# Altium schematic sheet Sheet3.SchDoc
size A2
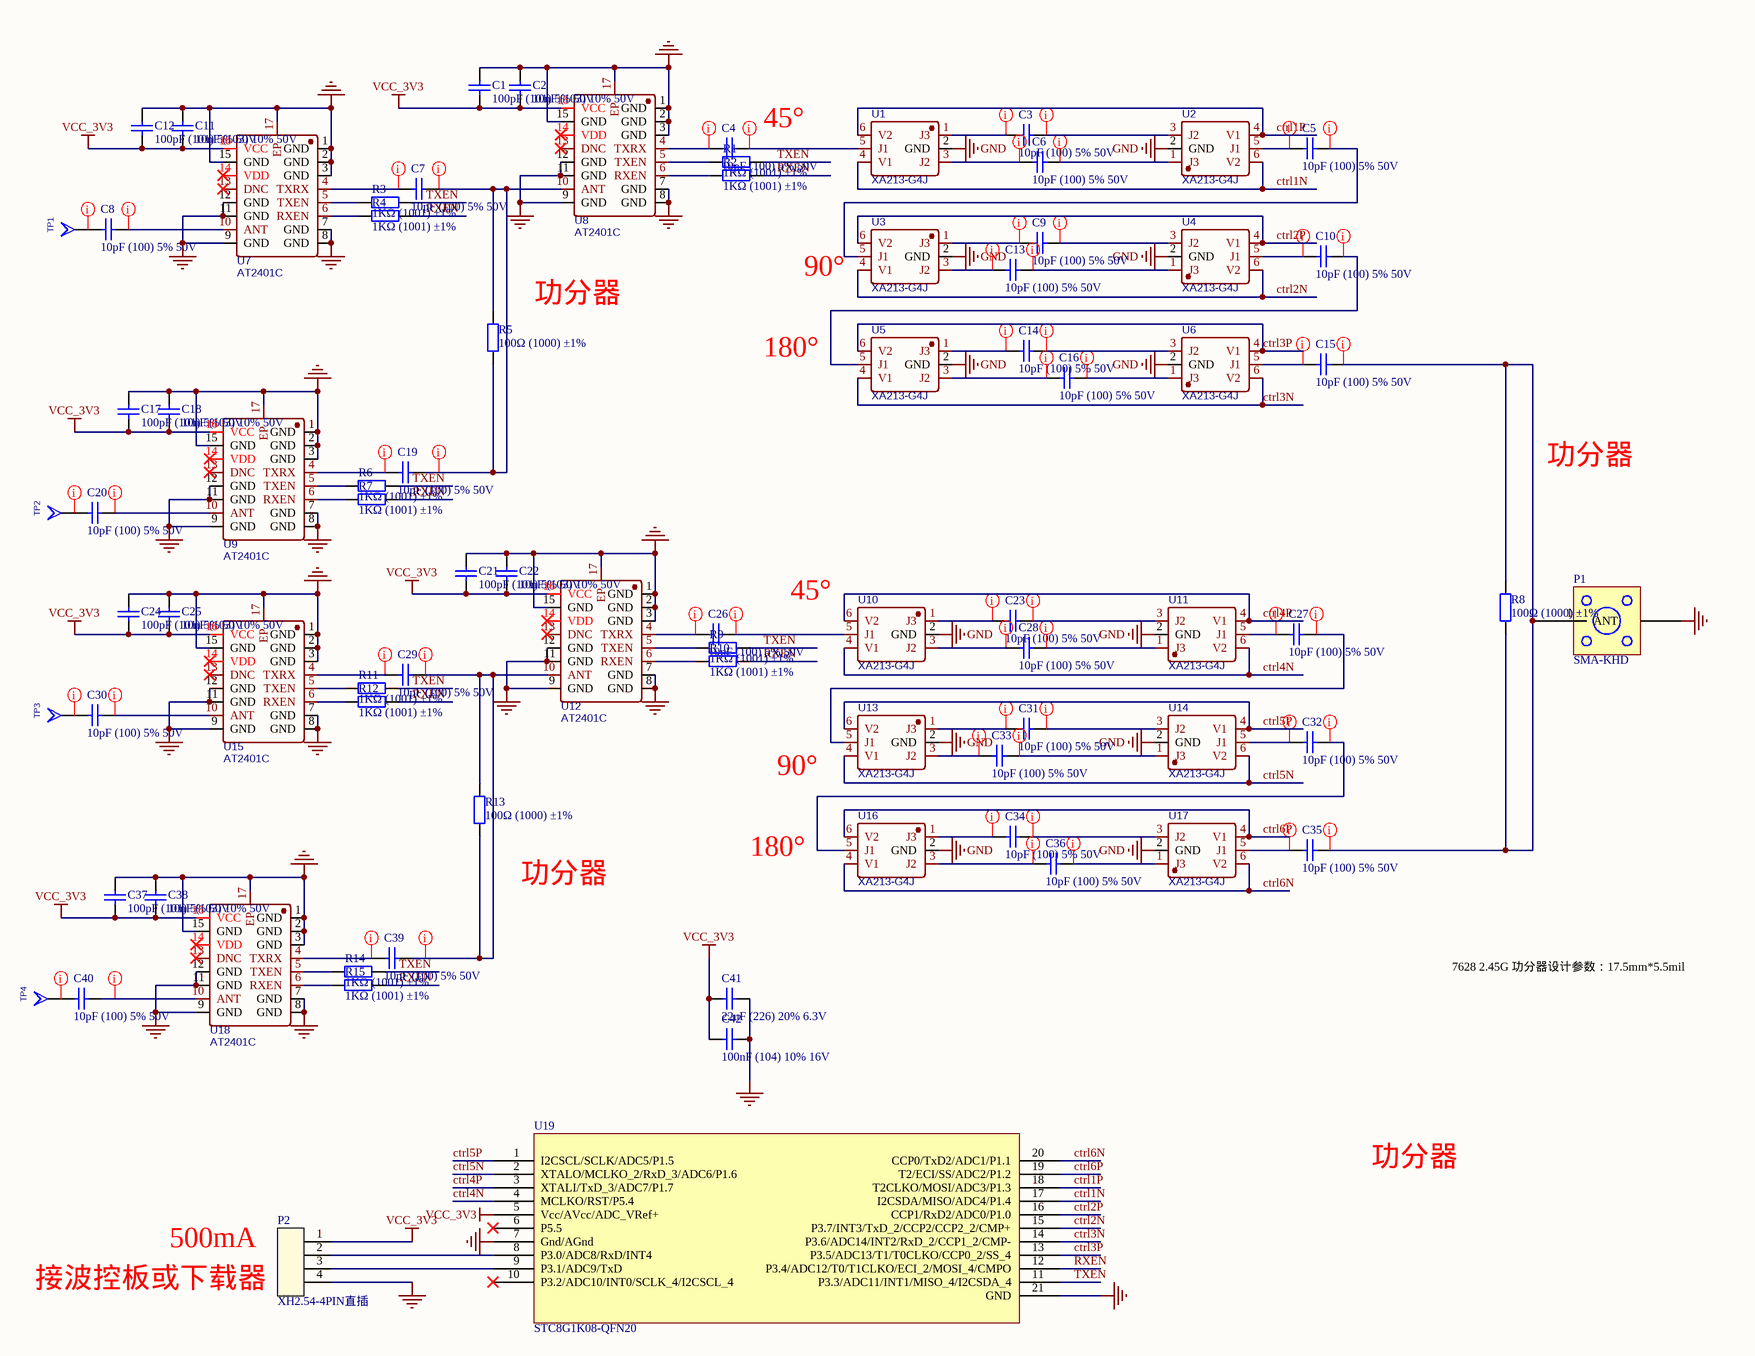
[diagram p0: Sheet3.SchDoc]

## Parts
C1  100pF (101) 5% 50V  [0402_C]
C2  10nF (103) 10% 50V  [0402_C]
C3  10pF (100) 5% 50V  [0402_C]
C4  10pF (100) 5% 50V  [0402_C]
C5  10pF (100) 5% 50V  [0402_C]
C6  10pF (100) 5% 50V  [0402_C]
C7  10pF (100) 5% 50V  [0402_C]
C8  10pF (100) 5% 50V  [0402_C]
C9  10pF (100) 5% 50V  [0402_C]
C10  10pF (100) 5% 50V  [0402_C]
C11  10nF (103) 10% 50V  [0402_C]
C12  100pF (101) 5% 50V  [0402_C]
C13  10pF (100) 5% 50V  [0402_C]
C14  10pF (100) 5% 50V  [0402_C]
C15  10pF (100) 5% 50V  [0402_C]
C16  10pF (100) 5% 50V  [0402_C]
C17  100pF (101) 5% 50V  [0402_C]
C18  10nF (103) 10% 50V  [0402_C]
C19  10pF (100) 5% 50V  [0402_C]
C20  10pF (100) 5% 50V  [0402_C]
C21  100pF (101) 5% 50V  [0402_C]
C22  10nF (103) 10% 50V  [0402_C]
C23  10pF (100) 5% 50V  [0402_C]
C24  100pF (101) 5% 50V  [0402_C]
C25  10nF (103) 10% 50V  [0402_C]
C26  10pF (100) 5% 50V  [0402_C]
C27  10pF (100) 5% 50V  [0402_C]
C28  10pF (100) 5% 50V  [0402_C]
C29  10pF (100) 5% 50V  [0402_C]
C30  10pF (100) 5% 50V  [0402_C]
C31  10pF (100) 5% 50V  [0402_C]
C32  10pF (100) 5% 50V  [0402_C]
C33  10pF (100) 5% 50V  [0402_C]
C34  10pF (100) 5% 50V  [0402_C]
C35  10pF (100) 5% 50V  [0402_C]
C36  10pF (100) 5% 50V  [0402_C]
C37  100pF (101) 5% 50V  [0402_C]
C38  10nF (103) 10% 50V  [0402_C]
C39  10pF (100) 5% 50V  [0402_C]
C40  10pF (100) 5% 50V  [0402_C]
C41  22uF (226) 20% 6.3V  [0603_C]
C42  100nF (104) 10% 16V  [0402_C]
P1  SMA-KHD  [SMA-KHD]
P2  XH2.54-4PIN直插  [XH2.54-4PIN直插]
R1  1KΩ (1001) ±1%  [0402_R]
R2  1KΩ (1001) ±1%  [0402_R]
R3  1KΩ (1001) ±1%  [0402_R]
R4  1KΩ (1001) ±1%  [0402_R]
R5  100Ω (1000) ±1%  [0402_R]
R6  1KΩ (1001) ±1%  [0402_R]
R7  1KΩ (1001) ±1%  [0402_R]
R8  100Ω (1000) ±1%  [0402_R]
R9  1KΩ (1001) ±1%  [0402_R]
R10  1KΩ (1001) ±1%  [0402_R]
R11  1KΩ (1001) ±1%  [0402_R]
R12  1KΩ (1001) ±1%  [0402_R]
R13  100Ω (1000) ±1%  [0402_R]
R14  1KΩ (1001) ±1%  [0402_R]
R15  1KΩ (1001) ±1%  [0402_R]
TP1  TP-1  [040_TESTPOINT]  (value not drawn)
TP2  TP-1  [040_TESTPOINT]  (value not drawn)
TP3  TP-1  [040_TESTPOINT]  (value not drawn)
TP4  TP-1  [040_TESTPOINT]  (value not drawn)
U1  XA213-G4J  [SOT-363_L2.0-W1.3-P0.65-LS2.1-BR]
U2  XA213-G4J  [SOT-363_L2.0-W1.3-P0.65-LS2.1-BR]
U3  XA213-G4J  [SOT-363_L2.0-W1.3-P0.65-LS2.1-BR]
U4  XA213-G4J  [SOT-363_L2.0-W1.3-P0.65-LS2.1-BR]
U5  XA213-G4J  [SOT-363_L2.0-W1.3-P0.65-LS2.1-BR]
U6  XA213-G4J  [SOT-363_L2.0-W1.3-P0.65-LS2.1-BR]
U7  AT2401C  [QFN-16_L3.0-W3.0-P0.50-BL-EP1.7]
U8  AT2401C  [QFN-16_L3.0-W3.0-P0.50-BL-EP1.7]
U9  AT2401C  [QFN-16_L3.0-W3.0-P0.50-BL-EP1.7]
U10  XA213-G4J  [SOT-363_L2.0-W1.3-P0.65-LS2.1-BR]
U11  XA213-G4J  [SOT-363_L2.0-W1.3-P0.65-LS2.1-BR]
U12  AT2401C  [QFN-16_L3.0-W3.0-P0.50-BL-EP1.7]
U13  XA213-G4J  [SOT-363_L2.0-W1.3-P0.65-LS2.1-BR]
U14  XA213-G4J  [SOT-363_L2.0-W1.3-P0.65-LS2.1-BR]
U15  AT2401C  [QFN-16_L3.0-W3.0-P0.50-BL-EP1.7]
U16  XA213-G4J  [SOT-363_L2.0-W1.3-P0.65-LS2.1-BR]
U17  XA213-G4J  [SOT-363_L2.0-W1.3-P0.65-LS2.1-BR]
U18  AT2401C  [QFN-16_L3.0-W3.0-P0.50-BL-EP1.7]
U19  STC8G1K08-QFN20  [QFN20(3x3)]

## Nets
GND: C1.2 C2.2 C11.2 C12.2 C17.2 C18.2 C21.2 C22.2 C24.2 C25.2 C37.2 C38.2 C41.2 C42.2 P1.0(GND) P2.4 U1.2(GND) U2.2(GND) U3.2(GND) U4.2(GND) U5.2(GND) U6.2(GND) U7.1(GND) U7.2(GND) U7.3(GND) U7.7(GND) U7.8(GND) U7.9(GND) U7.11(GND) U7.12(GND) U7.15(GND) U7.17(EP) U8.1(GND) U8.2(GND) U8.3(GND) U8.7(GND) U8.8(GND) U8.9(GND) U8.11(GND) U8.12(GND) U8.15(GND) U8.17(EP) U9.1(GND) U9.2(GND) U9.3(GND) U9.7(GND) U9.8(GND) U9.9(GND) U9.11(GND) U9.12(GND) U9.15(GND) U9.17(EP) U10.2(GND) U11.2(GND) U12.1(GND) U12.2(GND) U12.3(GND) U12.7(GND) U12.8(GND) U12.9(GND) U12.11(GND) U12.12(GND) U12.15(GND) U12.17(EP) U13.2(GND) U14.2(GND) U15.1(GND) U15.2(GND) U15.3(GND) U15.7(GND) U15.8(GND) U15.9(GND) U15.11(GND) U15.12(GND) U15.15(GND) U15.17(EP) U16.2(GND) U17.2(GND) U18.1(GND) U18.2(GND) U18.3(GND) U18.7(GND) U18.8(GND) U18.9(GND) U18.11(GND) U18.12(GND) U18.15(GND) U18.17(EP) U19.7(Gnd/AGnd) U19.21(GND)
VCC_3V3: C1.1 C2.1 C11.1 C12.1 C17.1 C18.1 C21.1 C22.1 C24.1 C25.1 C37.1 C38.1 C41.1 C42.1 P2.1 U7.16(VCC) U8.16(VCC) U9.16(VCC) U12.16(VCC) U15.16(VCC) U18.16(VCC) U19.5(Vcc/AVcc/ADC_VRef+)
ctrl1N: U1.4(V1) U2.6(V2) U19.17(I2CSDA/MISO/ADC4/P1.4)
ctrl1P: U1.6(V2) U2.4(V1) U19.18(T2CLKO/MOSI/ADC3/P1.3)
ctrl2N: U3.4(V1) U4.6(V2) U19.15(P3.7/INT3/TxD_2/CCP2/CCP2_2/CMP+)
ctrl2P: U3.6(V2) U4.4(V1) U19.16(CCP1/RxD2/ADC0/P1.0)
ctrl3N: U5.4(V1) U6.6(V2) U19.14(P3.6/ADC14/INT2/RxD_2/CCP1_2/CMP-)
ctrl3P: U5.6(V2) U6.4(V1) U19.13(P3.5/ADC13/T1/T0CLKO/CCP0_2/SS_4)
ctrl4N: U10.4(V1) U11.6(V2) U19.4(MCLKO/RST/P5.4)
ctrl4P: U10.6(V2) U11.4(V1) U19.3(XTALI/TxD_3/ADC7/P1.7)
ctrl5N: U13.4(V1) U14.6(V2) U19.2(XTALO/MCLKO_2/RxD_3/ADC6/P1.6)
ctrl5P: U13.6(V2) U14.4(V1) U19.1(I2CSCL/SCLK/ADC5/P1.5)
ctrl6N: U16.4(V1) U17.6(V2) U19.20(CCP0/TxD2/ADC1/P1.1)
ctrl6P: U16.6(V2) U17.4(V1) U19.19(T2/ECI/SS/ADC2/P1.2)
RXEN: R2.2 R4.2 R7.2 R10.2 R12.2 R15.2 U19.12(P3.4/ADC12/T0/T1CLKO/ECI_2/MOSI_4/CMPO)
TXEN: R1.2 R3.2 R6.2 R9.2 R11.2 R14.2 U19.11(P3.3/ADC11/INT1/MISO_4/I2CSDA_4)
NetC3_1: C3.1 U1.1(J3)
NetC3_2: C3.2 U2.3(J2)
NetC4_1: C4.1 U8.4(TXRX)
NetC4_2: C4.2 U1.5(J1)
NetC5_1: C5.1 U2.5(J1)
NetC5_2: C5.2 U3.5(J1)
NetC6_1: C6.1 U1.3(J2)
NetC6_2: C6.2 U2.1(J3)
NetC7_1: C7.1 U7.4(TXRX)
NetC7_2: C7.2 C19.2 R5.1 R5.2 U8.10(ANT)
NetC8_1: C8.1 TP1.A
NetC8_2: C8.2 U7.10(ANT)
NetC9_1: C9.1 U3.1(J3)
NetC9_2: C9.2 U4.3(J2)
NetC10_1: C10.1 U4.5(J1)
NetC10_2: C10.2 U5.5(J1)
NetC13_1: C13.1 U3.3(J2)
NetC13_2: C13.2 U4.1(J3)
NetC14_1: C14.1 U5.1(J3)
NetC14_2: C14.2 U6.3(J2)
NetC15_1: C15.1 U6.5(J1)
NetC15_2: C15.2 C35.2 P1.1(ANT) R8.1 R8.2
NetC16_1: C16.1 U5.3(J2)
NetC16_2: C16.2 U6.1(J3)
NetC19_1: C19.1 U9.4(TXRX)
NetC20_1: C20.1 TP2.A
NetC20_2: C20.2 U9.10(ANT)
NetC23_1: C23.1 U10.1(J3)
NetC23_2: C23.2 U11.3(J2)
NetC26_1: C26.1 U12.4(TXRX)
NetC26_2: C26.2 U10.5(J1)
NetC27_1: C27.1 U11.5(J1)
NetC27_2: C27.2 U13.5(J1)
NetC28_1: C28.1 U10.3(J2)
NetC28_2: C28.2 U11.1(J3)
NetC29_1: C29.1 U15.4(TXRX)
NetC29_2: C29.2 C39.2 R13.1 R13.2 U12.10(ANT)
NetC30_1: C30.1 TP3.A
NetC30_2: C30.2 U15.10(ANT)
NetC31_1: C31.1 U13.1(J3)
NetC31_2: C31.2 U14.3(J2)
NetC32_1: C32.1 U14.5(J1)
NetC32_2: C32.2 U16.5(J1)
NetC33_1: C33.1 U13.3(J2)
NetC33_2: C33.2 U14.1(J3)
NetC34_1: C34.1 U16.1(J3)
NetC34_2: C34.2 U17.3(J2)
NetC35_1: C35.1 U17.5(J1)
NetC36_1: C36.1 U16.3(J2)
NetC36_2: C36.2 U17.1(J3)
NetC39_1: C39.1 U18.4(TXRX)
NetC40_1: C40.1 TP4.A
NetC40_2: C40.2 U18.10(ANT)
NetP2_2: P2.2 U19.8(P3.0/ADC8/RxD/INT4)
NetP2_3: P2.3 U19.9(P3.1/ADC9/TxD)
NetR1_1: R1.1 U8.5(TXEN)
NetR2_1: R2.1 U8.6(RXEN)
NetR3_1: R3.1 U7.5(TXEN)
NetR4_1: R4.1 U7.6(RXEN)
NetR6_1: R6.1 U9.5(TXEN)
NetR7_1: R7.1 U9.6(RXEN)
NetR9_1: R9.1 U12.5(TXEN)
NetR10_1: R10.1 U12.6(RXEN)
NetR11_1: R11.1 U15.5(TXEN)
NetR12_1: R12.1 U15.6(RXEN)
NetR14_1: R14.1 U18.5(TXEN)
NetR15_1: R15.1 U18.6(RXEN)

Not connected (* = marked no-connect by the designer): U7 13(DNC)* 14(VDD)*; U8 13(DNC)* 14(VDD)*; U9 13(DNC)* 14(VDD)*; U12 13(DNC)* 14(VDD)*; U15 13(DNC)* 14(VDD)*; U18 13(DNC)* 14(VDD)*; U19 6(P5.5)* 10(P3.2/ADC10/INT0/SCLK_4/I2CSCL_4)*

## Layout directives
net class RF: NetC3_1, NetC3_2, NetC4_1, NetC4_2, NetC5_1, NetC5_2, NetC6_1, NetC6_2, NetC7_1, NetC7_2, NetC8_1, NetC8_2, NetC9_1, NetC9_2, NetC10_1, NetC10_2, NetC13_1, NetC13_2, NetC14_1, NetC14_2, NetC15_1, NetC15_2, NetC16_1, NetC16_2, NetC19_1, NetC20_1, NetC20_2, NetC23_1, NetC23_2, NetC26_1, NetC26_2, NetC27_1, NetC27_2, NetC28_1, NetC28_2, NetC29_1, NetC29_2, NetC30_1, NetC30_2, NetC31_1, NetC31_2, NetC32_1, NetC32_2, NetC33_1, NetC33_2, NetC34_1, NetC34_2, NetC35_1, NetC36_1, NetC36_2, NetC39_1, NetC40_1, NetC40_2

## Notes on the sheet
- 45°
- (near U3) 90°
- (near R5) 功分器
- (near U5) 180°
- 功分器
- (near U10) 45°
- (near U13) 90°
- (near R13) 功分器
- (near U16) 180°
- 7628 2.45G 功分器设计参数：17.5mm*5.5mil
- 接波控板或下载器
- 500mA

## Library data of the parts
C1 C12 C17 C21 C24 C37 = 0402 100pF (101) 5% 50V: 贴片电容; ComponentLink1Description: 供应商链接; ComponentLink1URL: http://www.szlcsc.com/product/details_1898.html; Package: 0402; Supplier: LC; SuppliersPartNumber: C1546
C2 C11 C18 C22 C25 C38 = 0402 10nF (103) 10% 50V: 贴片电容; ComponentLink1Description: 供应商链接; ComponentLink1URL: http://www.szlcsc.com/product/details_15869.html; Package: 0402; Supplier: LC; SuppliersPartNumber: C15195
C3-C10 C13-C16 C19 C20 C23 C26-C36 C39 C40 = 0402 10pF (100) 5% 50V: 贴片电容; ComponentLink1Description: 供应商链接; ComponentLink1URL: http://www.szlcsc.com/product/details_33914.html; Package: 0402; Supplier: LC; SuppliersPartNumber: C32949
C41 = 0603 22uF (226) 20% 6.3V: 贴片电容; ComponentLink1Description: 供应商链接; ComponentLink1URL: http://www.szlcsc.com/product/details_60514.html; Package: 0603; Supplier: LC; SuppliersPartNumber: C59461
C42 = 0402 100nF (104) 10% 16V: 贴片电容; ComponentLink1Description: 供应商链接; ComponentLink1URL: http://www.szlcsc.com/product/details_1877.html; Package: 0402; Supplier: LC; SuppliersPartNumber: C1525
P1 = SMA-KHD: SMA正插射频连接器; Supplier: *; SupplierspartNumber: *
P2 = XH2.54-4PIN直插: XH2.54-4PIN直插连接器; Supplier: *; SuppliersPartNumber: *
R1-R4 R6 R7 R9-R12 R14 R15 = 0402 1KΩ (1001) 1%: 贴片电阻; ComponentLink1Description: 供应商链接; ComponentLink1URL: http://www.szlcsc.com/product/details_12256.html; Package: 0402; Supplier: LC; SuppliersPartNumber: C11702
R5 R8 R13 = 0402 100Ω (1000) 1%: 贴片电阻; ComponentLink1Description: 供应商链接; ComponentLink1URL: http://www.szlcsc.com/product/details_25819.html; Package: 0402; Supplier: LC; SuppliersPartNumber: C25076
U1-U6 U10 U11 U13 U14 U16 U17 = XA213-G4J: BOM_Manufacturer: XINLUDA(信路达); Contributor: LCSC; BOM_Supplier: LCSC; BOM_Supplier Part: C556294; BOM_Manufacturer Part: XA213-G4J; BOM_JLCPCB Part Class: Extended Part; spicePre: U; spiceSymbolName: XA213-G4J
U7-U9 U12 U15 U18 = AT2401C: BOM_Manufacturer: 杭州中科微; Contributor: LCSC; BOM_Supplier: LCSC; BOM_Supplier Part: C783588; BOM_Manufacturer Part: AT2401C; BOM_JLCPCB Part Class: Extended Part; spicePre: U; spiceSymbolName: AT2401C
U19 = STC8G1K08-QFN20: 超小封装8位51单片机; Supplier: STC; SuppliersPartNumber: 库存